# Altium schematic sheet lvSdbSchematic.SchDoc
size A4
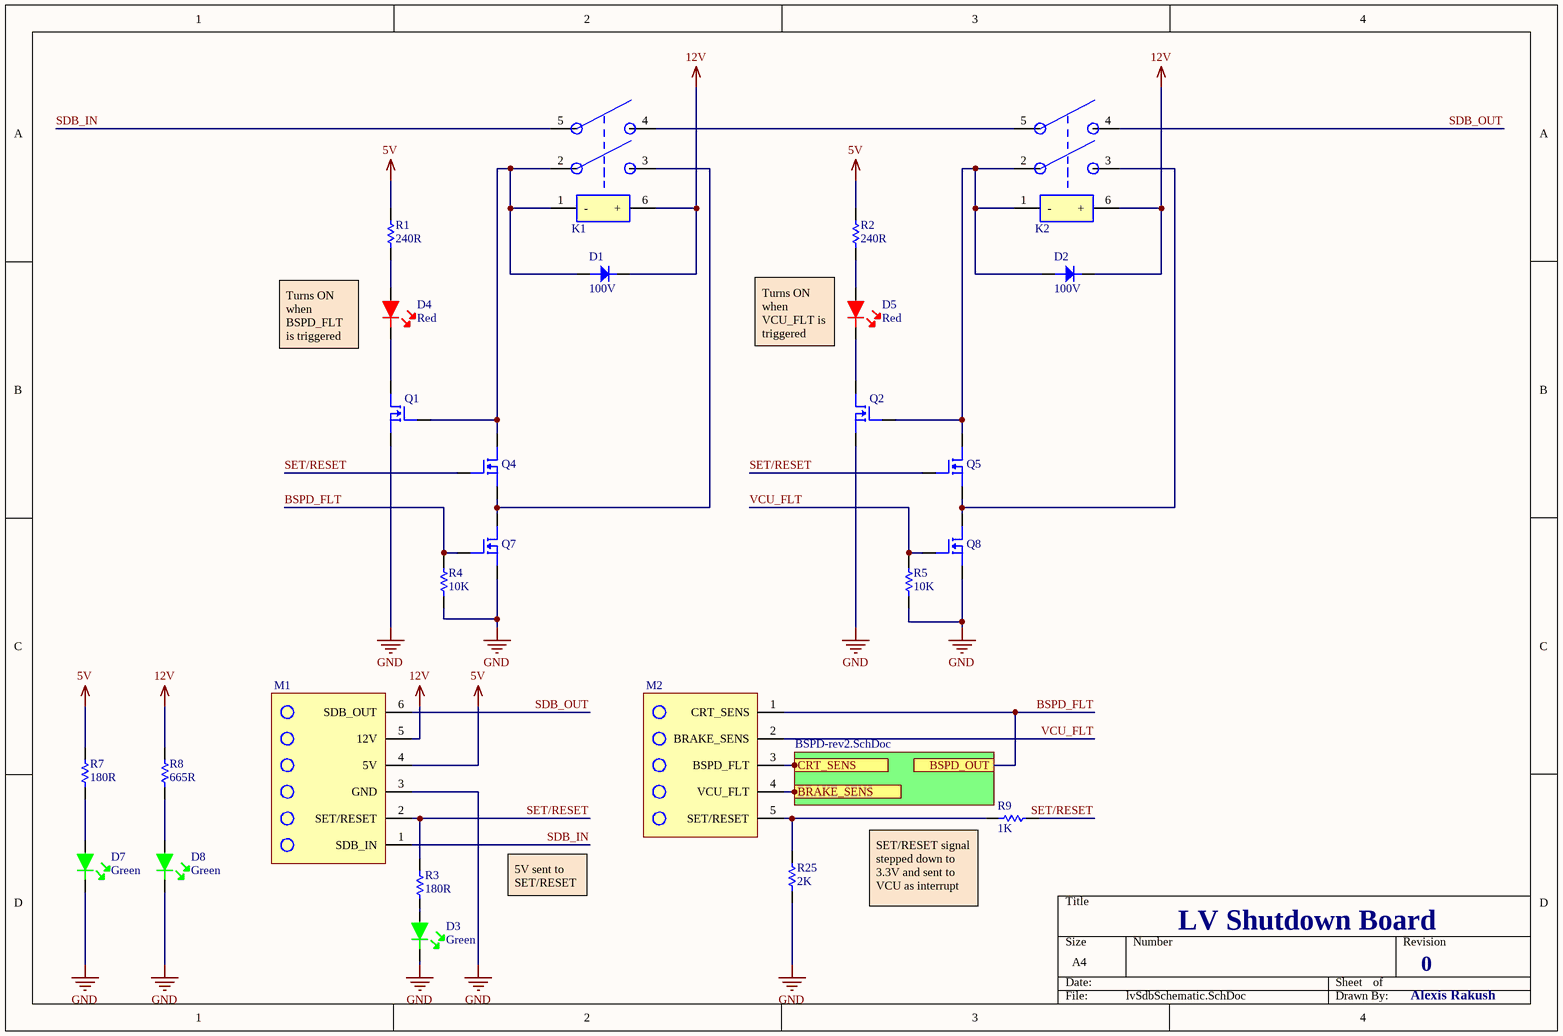
[diagram p0: lvSdbSchematic.SchDoc]

## Parts
D1  100V  [DO-214AA]
D2  100V  [DO-214AA]
D3  Green  [LED-0603]
D4  Red  [LED-0603]
D5  Red  [LED-0603]
D7  Green  [LED-0603]
D8  Green  [LED-0603]
K1  5-1419124-6  [RELAY DPST SDC]  (value not drawn)
K2  5-1419124-6  [RELAY DPST SDC]  (value not drawn)
M1  WM10676-ND  [6-PIN MOLEX]  (value not drawn)
M2  WM10672-ND  [5-PIN MOLEX]  (value not drawn)
Q1  DMN6140L-13DICT-ND  [SOT-23-3]  (value not drawn)
Q2  DMN6140L-13DICT-ND  [SOT-23-3]  (value not drawn)
Q4  DMN6140L-13DICT-ND  [SOT-23-3]  (value not drawn)
Q5  DMN6140L-13DICT-ND  [SOT-23-3]  (value not drawn)
Q7  DMN6140L-13DICT-ND  [SOT-23-3]  (value not drawn)
Q8  DMN6140L-13DICT-ND  [SOT-23-3]  (value not drawn)
R1  240R  [RES-0603]
R2  240R  [RES-0603]
R3  180R  [RES-0603]
R4  10K  [RES-0603]
R5  10K  [RES-0603]
R7  180R  [RES-0603]
R8  665R  [RES-0603]
R9  1K  [RES-0603]
R25  2K  [RES-0603]

## Sub-sheets
Designator = BSPD-rev2.SchDoc: CRT_SENS, BRAKE_SENS

## Ports
BRAKE_SENS, BSPD_OUT, CRT_SENS

## Nets
5V: M1.4(5V) R1.2 R2.2 R7.2
12V: D1.1 D2.1 K1.6(+) K2.6(+) M1.5(12V) R8.2
GND: D3.2 D7.2 D8.2 M1.3(GND) Q1.3 Q2.3 Q7.3 Q8.3 R4.1 R5.1 R25.1
BRAKE_SENS: M2.4(VCU_FLT) ; port BRAKE_SENS, sheet Designator/BRAKE_SENS
BSPD_FLT: M2.1(CRT_SENS) Q7.1 R4.2 ; port BSPD_OUT
CRT_SENS: M2.3(BSPD_FLT) ; port CRT_SENS, sheet Designator/CRT_SENS
SDB_IN: K1.5 M1.1(SDB_IN)
SDB_OUT: K2.4 M1.6(SDB_OUT)
SET/RESET: M1.2(SET/RESET) Q4.1 Q5.1 R3.1 R9.2
VCU_FLT: M2.2(BRAKE_SENS) Q8.1 R5.2
NetD1_2: D1.2 K1.1(-) K1.2 Q1.1 Q4.2
NetD2_2: D2.2 K2.1(-) K2.2 Q2.1 Q5.2
NetD3_1: D3.1 R3.2
NetD4_1: D4.1 R1.1
NetD4_2: D4.2 Q1.2
NetD5_1: D5.1 R2.1
NetD5_2: D5.2 Q2.2
NetD7_1: D7.1 R7.1
NetD8_1: D8.1 R8.1
NetK1_3: K1.3 Q4.3 Q7.2
NetK1_4: K1.4 K2.5
NetK2_3: K2.3 Q5.3 Q8.2
NetM2_5: M2.5(SET/RESET) R9.1 R25.2

## Notes on the sheet
- Turns ON when BSPD_FLT is triggered
- (near D5) Turns ON when VCU_FLT is triggered
- 5V sent to SET/RESET
- (near R9) SET/RESET signal stepped down to 3.3V and sent to VCU as interrupt
- LV Shutdown Board
- 0
- Alexis Rakush

## Library data of the parts
D1 D2 = Diode-100V-3A: DIODE GEN PURP 100V 3A DO214AA; Manufacturer: MCC; Manufacturer Part Number: S3BB-TP; Max Surge Current: 100A; Forward Voltage: 1.15V; Peak Reverse Current: 10uA; Element Configuration: Single; Supplier 1: Digi-Key; Stock 1: 9444; Pricing 1: 1=0.46, 10=0.376, 25=0.344, 100=0.216, 250=0.2136, 500=0.2, 1000=0.136 (USD); Mount: Surface Mount; Number of Pins: 2; Packaging: Tape and Reel; Package Quantity: 1; Average Rectified Current: 3A; Peak Non-Repetitive Surge Current: 100A; Max Repetitive Reverse Voltage (Vrrm): 100V; Reverse Voltage: 100V; Max Reverse Voltage (DC): 100V; Radiation Hardening: No; Lead Free: Lead Free; ComponentLink1URL: http://www.mccsemi.com/up_pdf/S3AB-S3MB(SMB).PDF?src-supplier=Digi-Key; ComponentLink1Description: http://www.mccsemi.com/up_pdf/S3AB-S3MB(SMB).PDF?src-supplier=Digi-Key; ComponentLink2URL: https://www.verical.com/server-webapp/html/getDatasheet?partID=686538&src-supplier=Verical; ComponentLink2Description: https://www.verical.com/server-webapp/html/getDatasheet?partID=686538&src-supplier=Verical; ComponentLink3URL: http://www.mccsemi.com/up_pdf/S3AB-S3MB(SMB).PDF?src-supplier=Future+Electronics; ComponentLink3Description: http://www.mccsemi.com/up_pdf/S3AB-S3MB(SMB).PDF?src-supplier=Future+Electronics; Supplier Part Number 1: S3BB-TPMSDKR-ND
D3 D7 D8 = LED-Green: LED GREEN CLEAR 0603 SMD; Manufacturer: Wurth Electronics; Manufacturer Part Number: 150060VS75000; Luminous Intensity: 40mcd; Viewing Angle: 140°; Forward Voltage: 2V; Wavelength: 570nm; Lens Style: Clear,Rectangular; Forward Current: 30mA; Test Current: 20mA; Supplier 1: Digi-Key; Stock 1: 118118; Pricing 1: 1=0.14, 50=0.133, 100=0.114, 500=0.099 (USD); Mount: Surface Mount; Case/Package: 0603; Number of Pins: 2; Color: Green; Case Code (Metric): 1608; Case Code (Imperial): 0603; Min Operating Temperature: -40°C; Max Operating Temperature: 85°C; Package Quantity: 1; Packaging: Tape and Reel; Dominant Wavelength: 570nm; Length: 1.6mm; Height: 0.7mm; Width: 0.8mm; REACH SVHC: Unknown; ComponentLink1URL: https://katalog.we-online.de/led/datasheet/150060VS75000.pdf?src-supplier=Digi-Key; ComponentLink1Description: https://katalog.we-online.de/led/datasheet/150060VS75000.pdf?src-supplier=Digi-Key; Supplier Part Number 1: 732-4980-1-ND
D4 D5 = LED-Red: LED RED CLEAR 0603 SMD; Manufacturer: Wurth Electronics; Manufacturer Part Number: 150060RS75000; Viewing Angle: 140°; Lens Style: Clear,Rectangular; Luminous Intensity: 250mcd; Forward Current: 30mA; Forward Voltage: 2V; Wavelength: 625nm; Test Current: 20mA; Supplier 1: Digi-Key; Stock 1: 18518; Pricing 1: 1=0.14, 50=0.133, 100=0.114, 500=0.099 (USD); Mount: Surface Mount; Case/Package: 0603; Color: Red; Case Code (Metric): 1608; Case Code (Imperial): 0603; Min Operating Temperature: -40°C; Max Operating Temperature: 85°C; Package Quantity: 1; Packaging: Cut Tape; Dominant Wavelength: 625nm; Length: 1.6mm; Height: 0.7mm; Width: 0.8mm; REACH SVHC: Unknown; ComponentLink1URL: https://katalog.we-online.de/led/datasheet/150060RS75000.pdf?src-supplier=Digi-Key; ComponentLink1Description: https://katalog.we-online.de/led/datasheet/150060RS75000.pdf?src-supplier=Digi-Key; ComponentLink2URL: http://www.produktinfo.conrad.com/datenblaetter/750000-774999/759428-da-01-en-CHIPLED_0603_W_KL_ROT_150060RS75000.pdf?src-supplier=Conrad; ComponentLink2Description: http://www.produktinfo.conrad.com/datenblaetter/750000-774999/759428-da-01-en-CHIPLED_0603_W_KL_ROT_150060RS75000.pdf?src-supplier=Conrad; Supplier Part Number 1: 732-4978-6-ND
K1 K2 = 5-1419124-6: General Purpose Relay, Osa Series, Power, Non Latching, Dpst-No, 12 Vdc, 3 A Rohs Compliant: Yes; Manufacturer: TE Connectivity; Contact Current Rating: 3A; Coil Current: 45mA; Throw Configuration: DPST; Operate Time: 20ms; Release Time: 10ms; Coil Power: 600mW; Coil Resistance: 270R; Coil Type: Non-Latching; Coil Voltage (DC): 12V; Contact Voltage Rating (AC): 240V; Supplier 1: Digi-Key; Manufacturer Part Number: 5-1419124-6; Stock 1: 2593; Pricing 1: 1=2.54, 10=2.385, 25=2.1204, 50=2.0142, 100=1.9083, 250=1.69624, 500=1.59022, 1000=1.48421, 5000=1.4312 (USD); Mount: Through Hole; Weight: 13g; Contact Material: Silver; Min Operating Temperature: -30°C; Max Operating Temperature: 60°C; Package Quantity: 1000; Packaging: Box; Termination: PCB; Relay Type: General Purpose; Length: 24.4mm; Height: 0.976inch; Width: 12.9mm; ELV: Compliant; REACH SVHC: Unknown; ComponentLink1URL: http://www.farnell.com/datasheets/1652820.pdf?src-supplier=Farnell; ComponentLink1Description: http://www.farnell.com/datasheets/1652820.pdf?src-supplier=Farnell; ComponentLink2URL: http://www.farnell.com/cad/1652820.pdf?src-supplier=Element14; ComponentLink2Description: http://www.farnell.com/cad/1652820.pdf?src-supplier=Element14; ComponentLink3URL: http://www.te.com/commerce/DocumentDelivery/DDEController?Action=srchrtrv&DocNm=5-1419124-6&DocType=Customer+Drawing&DocLang=English&src-supplier=Digi-Key; ComponentLink3Description: http://www.te.com/commerce/DocumentDelivery/DDEController?Action=srchrtrv&DocNm=5-1419124-6&DocType=Customer+Drawing&DocLang=English&src-supplier=Digi-Key; Supplier Part Number 1: OSA-SS-212DM3,000-ND; Category: Relays
M1 = 6 PIN HDR: CONN HEADER VERT 6POS 3MM; Supplier 1: Digi-Key; Supplier Part Number 1: WM10676-ND
M2 = 5 PIN HDR: CONN HEADER VERT 5POS 3MM; Supplier 1: Digi-Key; Supplier Part Number 1: WM10672-ND
Q1 Q2 Q4 Q5 Q7 Q8 = N-FET-60V-1.6A: MOSFET N-CH 60V 1.6A SOT23; Manufacturer: Diodes; Rds On Max: 140mR; Input Capacitance: 315pF; Max Power Dissipation: 700mW; Supplier 1: Digi-Key; Manufacturer Part Number: DMN6140L-13; Stock 1: 274948; Pricing 1: 1=0.34, 10=0.256, 25=0.224, 100=0.1217, 250=0.12104, 500=0.09926, 1000=0.07365, 2500=0.06468, 5000=0.05924 (USD); Mount: Surface Mount; Case/Package: TO-236-3; Min Operating Temperature: -55°C; Max Operating Temperature: 150°C; Package Quantity: 10000; Packaging: Cut Tape; Drain to Source Voltage (Vdss): 60V; Continuous Drain Current (ID): 1.6A; ComponentLink1URL: https://www.diodes.com/assets/Datasheets/DMN6140L.pdf?src-supplier=Digi-Key; ComponentLink1Description: https://www.diodes.com/assets/Datasheets/DMN6140L.pdf?src-supplier=Digi-Key; Supplier Part Number 1: DMN6140L-13DIDKR-ND
R1 R2 = 0603-240R: RES 240 OHM 1% 1/10W 0603; Manufacturer: Stackpole Electronics; Manufacturer Part Number: RMCF0603FT240R; Power Rating: 100mW; Temperature Coefficient: 100ppm/°C; Supplier 1: Digi-Key; Stock 1: 23096; Pricing 1: 1=0.1, 10=0.016, 100=0.0065, 1000=0.00292, 2500=0.00253 (USD); Mount: Surface Mount; Case/Package: 0603; Case Code (Metric): 1608; Case Code (Imperial): 0603; Contact Plating: Tin,Matte; Min Operating Temperature: -55°C; Max Operating Temperature: 155°C; Packaging: Tape and Reel; Resistance: 240R; Tolerance: 1%; Package Quantity: 5000; Composition: Thick Film; Number of Terminations: 2; Max Power Dissipation: 100mW; Features: Automotive AEC-Q200; Length: 0.061inch; Height: 0.022inch; Width: 0.031inch; Radiation Hardening: No; Lead Free: Lead Free; ComponentLink1URL: https://www.seielect.com/catalog/SEI-RMCF_RMCP.pdf?src-supplier=Avnet; ComponentLink1Description: https://www.seielect.com/catalog/SEI-RMCF_RMCP.pdf?src-supplier=Avnet; ComponentLink2URL: http://components.arrow.com/part/dataview/40960290S7280662N1174?src-supplier=Arrow; ComponentLink2Description: http://components.arrow.com/part/dataview/40960290S7280662N1174?src-supplier=Arrow; ComponentLink3URL: https://www.seielect.com/catalog/SEI-Packaging.pdf?src-supplier=Digi-Key; ComponentLink3Description: https://www.seielect.com/catalog/SEI-Packaging.pdf?src-supplier=Digi-Key; ComponentLink4URL: https://www.seielect.com/Catalog/SEI-RMCF_RMCP.pdf?src-supplier=Digi-Key; ComponentLink4Description: https://www.seielect.com/Catalog/SEI-RMCF_RMCP.pdf?src-supplier=Digi-Key; ComponentLink5URL: http://www.seielect.com/Catalog/SEI-RMC.pdf?src-supplier=Future+Electronics; ComponentLink5Description: http://www.seielect.com/Catalog/SEI-RMC.pdf?src-supplier=Future+Electronics; Supplier Part Number 1: 738-RMCF0603FT240RDKR-ND
R3 R7 = 0603-180R: RES SMD 180 OHM 1% 1/10W 0603; Manufacturer: TE Connectivity; Manufacturer Part Number: CRGCQ0603F180R; Max Power Dissipation: 100mW; Temperature Coefficient: 100ppm/°C; Supplier 1: Digi-Key; Stock 1: 17329; Pricing 1: 1=0.1, 10=0.03, 100=0.012, 1000=0.00541, 2500=0.00469 (USD); Case/Package: 0603; Case Code (Imperial): 0603; Case Code (Metric): 1608; Min Operating Temperature: -55°C; Max Operating Temperature: 155°C; Composition: Thick Film; Features: Moisture Resistant,Automotive AEC-Q200; Packaging: Tape and Reel; Resistance: 180R; Tolerance: 1%; Number of Terminations: 2; ComponentLink1URL: https://www.te.com/commerce/DocumentDelivery/DDEController?Action=srchrtrv&DocNm=1773204-3&DocType=DS&DocLang=English&src-supplier=Digi-Key; ComponentLink1Description: https://www.te.com/commerce/DocumentDelivery/DDEController?Action=srchrtrv&DocNm=1773204-3&DocType=DS&DocLang=English&src-supplier=Digi-Key; ComponentLink2URL: https://www.te.com/commerce/DocumentDelivery/DDEController?Action=srchrtrv&amp;DocNm=1773204-3&amp;DocType=DS&amp;DocLang=English&src-supplier=Digi-Key; ComponentLink2Description: https://www.te.com/commerce/DocumentDelivery/DDEController?Action=srchrtrv&amp;DocNm=1773204-3&amp;DocType=DS&amp;DocLang=English&src-supplier=Digi-Key; ComponentLink3URL: http://www.te.com/commerce/DocumentDelivery/DDEController?Action=srchrtrv&DocNm=1773204-3&DocType=DS&DocLang=English&src-supplier=Digi-Key; ComponentLink3Description: http://www.te.com/commerce/DocumentDelivery/DDEController?Action=srchrtrv&DocNm=1773204-3&DocType=DS&DocLang=English&src-supplier=Digi-Key; ComponentLink4URL: http://www.farnell.com/datasheets/2609223.pdf?src-supplier=Farnell; ComponentLink4Description: http://www.farnell.com/datasheets/2609223.pdf?src-supplier=Farnell; Supplier Part Number 1: A129679DKR-ND
R4 R5 = 0603-10KR: RES SMD 10K OHM 5% 1/10W 0603; Manufacturer: Yageo; Manufacturer Part Number: RC0603JR-0710KL; Resistance: 10kR; Voltage Rating (DC): 50V; Temperature Coefficient: 100ppm/°C; Power Rating: 100mW; Supplier 1: Digi-Key; Stock 1: 3006558; Pricing 1: 1=0.1, 10=0.019, 100=0.0077, 1000=0.00347, 2500=0.00301 (USD); Case/Package: 0603; Number of Pins: 2; Contact Plating: Tin,Matte; Case Code (Imperial): 0603; Case Code (Metric): 1608; Min Operating Temperature: -55°C; Max Operating Temperature: 155°C; Packaging: Tape and Reel; Tolerance: 5%; Composition: Thick Film; Voltage Rating: 50V; Termination: SMD/SMT; Military Standard: Not; Features: Moisture Resistant; Max Power Dissipation: 100mW; Number of Terminations: 2; Length: 0.063inch; Width: 0.031inch; Depth: 0.8mm; Height - Seated (Max): 0.022inch; Radiation Hardening: No; REACH SVHC: Unknown; Lead Free: Lead Free; ComponentLink1URL: http://www.yageo.com/documents/recent/PYu-RC_Group_51_RoHS_L_10.pdf?src-supplier=Digi-Key; ComponentLink1Description: http://www.yageo.com/documents/recent/PYu-RC_Group_51_RoHS_L_10.pdf?src-supplier=Digi-Key; Supplier Part Number 1: 311-10KGRDKR-ND
R8 = 0603-665R: RES SMD 665 OHM 1% 1/10W 0603; Manufacturer: Yageo; Manufacturer Part Number: RC0603FR-07665RL; Power Rating: 100mW; Voltage Rating: 75V; Temperature Coefficient: 100ppm/°C; Voltage Rating (DC): 50V; Supplier 1: Digi-Key; Stock 1: 143871; Pricing 1: 1=0.1, 10=0.023, 100=0.0094, 1000=0.00421, 2500=0.00366 (USD); Case/Package: 0603; Weight: 7.1E-05oz; Case Code (Imperial): 0603; Case Code (Metric): 1608; Contact Plating: Tin,Matte; Min Operating Temperature: -55°C; Max Operating Temperature: 155°C; Resistance: 665R; Tolerance: 1%; Packaging: Tape and Reel; Termination: SMD/SMT; Composition: Thick Film; Military Standard: Not; Package Quantity: 1; Number of Terminations: 2; Max Power Dissipation: 100mW; Features: Moisture Resistant; Length: 1.6mm; Height: 0.022inch; Width: 0.8mm; Depth: 0.8mm; Lead Free: Lead Free; ComponentLink1URL: http://www.yageo.com/documents/recent/PYu-RC_Group_51_RoHS_L_9.pdf?src-supplier=Digi-Key; ComponentLink1Description: http://www.yageo.com/documents/recent/PYu-RC_Group_51_RoHS_L_9.pdf?src-supplier=Digi-Key; ComponentLink2URL: http://www.yageo.com/documents/recent/PYu-RC0603_51_RoHS_L_4.pdf?src-supplier=Avnet; ComponentLink2Description: http://www.yageo.com/documents/recent/PYu-RC0603_51_RoHS_L_4.pdf?src-supplier=Avnet; ComponentLink3URL: http://www.yageo.com/documents/recent/PYu-RC_Group_51_RoHS_L_10.pdf?src-supplier=Digi-Key; ComponentLink3Description: http://www.yageo.com/documents/recent/PYu-RC_Group_51_RoHS_L_10.pdf?src-supplier=Digi-Key; ComponentLink4URL: http://www.yageo.com/documents/recent/PYu-RC0603_51_RoHS_L_4.pdf?src-supplier=Avnet+Europe; ComponentLink4Description: http://www.yageo.com/documents/recent/PYu-RC0603_51_RoHS_L_4.pdf?src-supplier=Avnet+Europe; Supplier Part Number 1: 311-665HRDKR-ND
R9 = 0603-1KR: RES SMD 1K OHM 1% 1/10W 0603; Manufacturer: Vishay Dale; Manufacturer Part Number: CRCW06031K00FKEA; Resistance: 1kR; Power Rating: 100mW; Voltage Rating: 75V; Temperature Coefficient: 100ppm/°C; Supplier 1: Digi-Key; Stock 1: 671453; Pricing 1: 1=0.1, 10=0.034, 100=0.0139, 1000=0.00623, 2500=0.0054 (USD); Mount: Surface Mount; Case/Package: 0603; Number of Pins: 2; Weight: 7.1E-05oz; Case Code (Metric): 1608; Case Code (Imperial): 0603; Contact Plating: Tin; Min Operating Temperature: -55°C; Max Operating Temperature: 155°C; Composition: Thick Film; Tolerance: 1%; Packaging: Tape and Reel; Package Quantity: 10; Number of Terminations: 2; Termination: SMD/SMT; Military Standard: Not; Max Power Dissipation: 100mW; Voltage Rating (DC): 75V; Features: Automotive AEC-Q200; Length: 1.55mm; Height: 0.45mm; Width: 0.033inch; Depth: 0.85mm; Radiation Hardening: No; REACH SVHC: Unknown; Lead Free: Lead Free; ComponentLink1URL: http://www.vishay.com/docs/20035/dcrcwe3.pdf?src-supplier=Digi-Key; ComponentLink1Description: http://www.vishay.com/docs/20035/dcrcwe3.pdf?src-supplier=Digi-Key; ComponentLink2URL: http://uk.rs-online.com/webdocs/0d98/0900766b80d98afc.pdf?src-supplier=RSComponents; ComponentLink2Description: http://uk.rs-online.com/webdocs/0d98/0900766b80d98afc.pdf?src-supplier=RSComponents; ComponentLink3URL: http://www.vishay.com/docs/20035/dcrcwe3.pdf?src-supplier=Avnet; ComponentLink3Description: http://www.vishay.com/docs/20035/dcrcwe3.pdf?src-supplier=Avnet; ComponentLink4URL: http://www.vishay.com/docs/20035/dcrcwe3.pdf?src-supplier=Avnet+Asia; ComponentLink4Description: http://www.vishay.com/docs/20035/dcrcwe3.pdf?src-supplier=Avnet+Asia; ComponentLink5URL: http://www.farnell.com/datasheets/2310790.pdf?src-supplier=Element14; ComponentLink5Description: http://www.farnell.com/datasheets/2310790.pdf?src-supplier=Element14; ComponentLink6URL: https://www.distrelec.biz/Web/Downloads/a_/en/flD-CRCW-e3_data_en.pdf?mime=application%2Fpdf&src-supplier=Distrelec; ComponentLink6Description: https://www.distrelec.biz/Web/Downloads/a_/en/flD-CRCW-e3_data_en.pdf?mime=application%2Fpdf&src-supplier=Distrelec; ComponentLink7URL: http://www.vishay.com/docs/20035/dcrcwe3.pdf?src-supplier=Future+Electronics; ComponentLink7Description: http://www.vishay.com/docs/20035/dcrcwe3.pdf?src-supplier=Future+Electronics; ComponentLink8URL: http://www.vishay.com/docs/20035/dcrcwe3.pdf?src-supplier=Avnet+Europe; ComponentLink8Description: http://www.vishay.com/docs/20035/dcrcwe3.pdf?src-supplier=Avnet+Europe; Supplier Part Number 1: 541-1.00KHCT-ND
R25 = 0603-2KR: RES SMD 2K OHM 1% 1/4W 0603; Manufacturer: Vishay Dale; Manufacturer Part Number: CRCW06032K00FKEAHP; Resistance: 2kR; Power Rating: 250mW; Voltage Rating: 75V; Temperature Coefficient: 100ppm/°C; Supplier 1: Digi-Key; Stock 1: 23723; Pricing 1: 1=0.17, 10=0.142, 100=0.0553, 1000=0.02317, 2500=0.02124 (USD); Mount: Surface Mount; Case/Package: 0603; Weight: 7.1E-05oz; Case Code (Metric): 1608; Case Code (Imperial): 0603; Contact Plating: Tin; Min Operating Temperature: -55°C; Max Operating Temperature: 155°C; Package Quantity: 10; Tolerance: 1%; Packaging: Tape and Reel; Composition: Thick Film; Number of Terminations: 2; Termination: Solder; Max Power Dissipation: 250mW; Features: Automotive AEC-Q200; Military Standard: Not; Length: 1.6mm; Height: 0.45mm; Width: 0.033inch; Depth: 0.85mm; Radiation Hardening: No; Lead Free: Lead Free; ComponentLink1URL: http://www.vishay.com/docs/20043/crcwhpe3.pdf?src-supplier=Digi-Key; ComponentLink1Description: http://www.vishay.com/docs/20043/crcwhpe3.pdf?src-supplier=Digi-Key; Supplier Part Number 1: 541-2.00KSDKR-ND